# EAGLE design SolarMonitor (EAGLE 9.2.1)
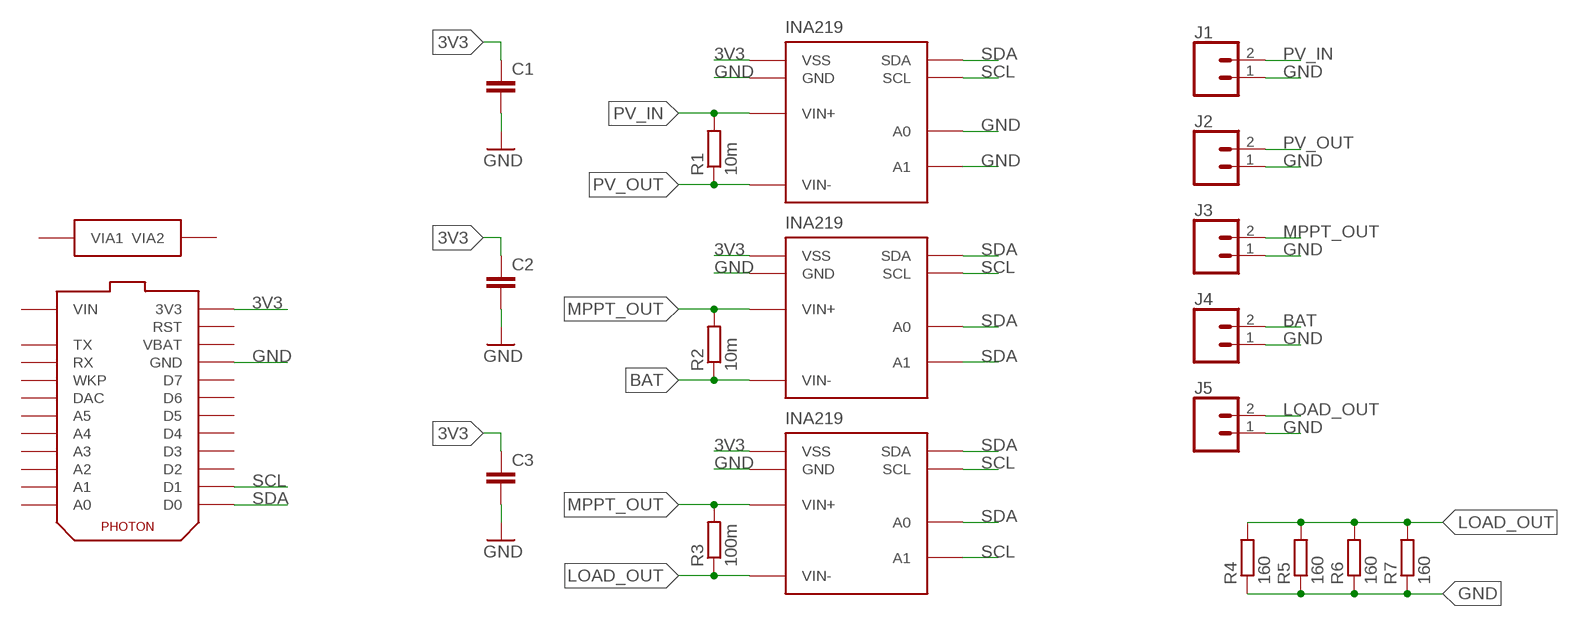
[diagram p0: schematic, sheet 1]

## Parts
C1  C-EU0.1UFC0603  [C0603]
C2  C-EU0.1UFC0603  [C0603]
C3  C-EU0.1UFC0603  [C0603]
J1  CONN_023.5MM  [SCREWTERMINAL-3.5MM-2]
J2  CONN_023.5MM  [SCREWTERMINAL-3.5MM-2]
J3  CONN_023.5MM  [SCREWTERMINAL-3.5MM-2]
J4  CONN_023.5MM  [SCREWTERMINAL-3.5MM-2]
J5  CONN_023.5MM  [SCREWTERMINAL-3.5MM-2]
R1  10m  R-EU_R0805  [R0805]
R2  10m  R-EU_R0805  [R0805]
R3  100m  R-EU_R0805  [R0805]
R4  160  R-EU_R1206  [R1206]
R5  160  R-EU_R1206  [R1206]
R6  160  R-EU_R1206  [R1206]
R7  160  R-EU_R1206  [R1206]
U$1  TEMPLATE_PHOTON_RAW  [PHOTON_RAW]
U$2  INA219  [SOIC_8]
U$3  INA219  [SOIC_8]
U$4  INA219  [SOIC_8]

## Nets
3V3: C1.1 C2.1 C3.1 U$1.3V3 U$1.3V3.(3V3) U$1.3V31(3V3) U$2.5(VSS) U$3.5(VSS) U$4.5(VSS)
BAT: J4.2 R2.1 U$3.7(VIN-)
GND: C1.2 C2.2 C3.2 J1.1 J2.1 J3.1 J4.1 J5.1 R4.1 R5.1 R6.1 R7.1 U$1.GND U$1.GND1(GND) U$1.GND.(GND) U$1.GND.@1(GND) U$1.GND@1(GND) U$1.GND@2(GND) U$2.1(A1) U$2.2(A0) U$2.6(GND) U$3.6(GND) U$4.6(GND)
LOAD_OUT: J5.2 R3.1 R4.2 R5.2 R6.2 R7.2 U$4.7(VIN-)
MPPT_OUT: J3.2 R2.2 R3.2 U$3.8(VIN+) U$4.8(VIN+)
PV_IN: J1.2 R1.2 U$2.8(VIN+)
PV_OUT: J2.2 R1.1 U$2.7(VIN-)
SCL: U$1.D1 U$1.D1.(D1) U$1.D1@1(D1) U$2.4(SCL) U$3.4(SCL) U$4.1(A1) U$4.4(SCL)
SDA: U$1.D0 U$1.D0.(D0) U$1.D0@1(D0) U$2.3(SDA) U$3.1(A1) U$3.2(A0) U$3.3(SDA) U$4.2(A0) U$4.3(SDA)
Unconnected: U$1.A0 U$1.A0.(A0) U$1.A0@1(A0) U$1.A1 U$1.A1.(A1) U$1.A1@1(A1) U$1.A2 U$1.A2.(A2) U$1.A2@1(A2) U$1.A3 U$1.A3.(A3) U$1.A3@1(A3) U$1.A4 U$1.A4.(A4) U$1.A4@1(A4) U$1.A5 U$1.A5.(A5) U$1.A5@1(A5) U$1.D2 U$1.D2.(D2) U$1.D2@1(D2) U$1.D3 U$1.D3.(D3) U$1.D3@1(D3) U$1.D4 U$1.D4.(D4) U$1.D4@1(D4) U$1.D5 U$1.D5.(D5) U$1.D5@1(D5) U$1.D6 U$1.D6.(D6) U$1.D6@1(D6) U$1.D7 U$1.D7.(D7) U$1.D7@1(D7) U$1.DAC U$1.DAC1(DAC) U$1.DAC.(DAC) U$1.P$1(VIA1) U$1.P$2(VIA2) U$1.RST U$1.RST1(RST) U$1.RST.(RST) U$1.RX U$1.RX1(RX) U$1.RX.(RX) U$1.TX U$1.TX1(TX) U$1.TX.(TX) U$1.VBAT U$1.VBAT1(VBAT) U$1.VBAT.(VBAT) U$1.VIN U$1.VIN1(VIN) U$1.VIN.(VIN) U$1.WKP U$1.WKP1(WKP) U$1.WKP.(WKP)

## Library data of the parts
C1-C3 = bschulz:C-EU: CAPACITOR, European symbol; DIGIKEY: 1276-1005-1-ND; MF: Samsung; MPN: CL10B104KO8NNNC
J1-J5 = bschulz:CONN_02: Genaric 2 terminal header SCREW_2.54 <https://www.digikey.com/product-detail/en/on-shore-technology-inc/OSTVN02A150/ED10561-ND/1588862>; PROD_ID: CONN-08399
R1-R7 = bschulz_passives:R-EU_: RESISTOR, European symbol Digikey Parts: Yageo, 0402 <https://www.digikey.com/products/en/resistors/chip-resistor-surface-mount/52?k=&pkeyword=&sf=0&FV=ffec1104%2Cfffc000d%2C1c0002%2C440067%2C1f140000%2Cffe00034%2C400004&quantity=&ColumnSort=0&page=1&stock=1&pageSize=25> Yageo, 0603 <https://www.digikey.com/products/en/resistors/chip-resistor-surface-mount/52?k=&pkeyword=&s=4356&s=47360&sf=0&FV=fffc000d%2C1c0002%2C142c040c%2C1f140000%2Cffe00034&quantity=10&ColumnSort=1000011&page=1&stock=1&pageSize=25> Panasonic, 0603 <https://www.digikey.com/products/en/resistors/chip-resistor-surface-mount/52?k=&pkeyword=&pv252=68&sf=0&FV=ffec373d%2C1c0002%2C142c040c%2C1f140000%2Cffe00034%2C80002%2Cc0001&quantity=&ColumnSort=0&page=1&stock=1&pageSize=25> Panasonic, precision, 0603 <https://www.digikey.com/products/en/resistors/chip-resistor-surface-mount/52?FV=ffec4907%2Cfffc000a%2Cc0172%2C142c040c%2C1f140000%2Cffe00034%2C1c0002&quantity=100&ColumnSort=2085&page=1&stock=1&pageSize=25> Panasonic, 0805 <https://www.digikey.com/products/en/resistors/chip-resistor-surface-mount/52?k=&pkeyword=&pv3=1&sf=0&FV=ffec373d%2C1c0002%2C1f140000%2Cffe00034%2C142c040d&quantity=&ColumnSort=0&page=1&stock=1&pageSize=25> Rohm, current sense <https://www.digikey.com/products/en/resistors/chip-resistor-surface-mount/52?k=&pkeyword=&pv3=1&sf=0&FV=ffecb688%2C1f140000%2Cffe00034%2C1c0002&quantity=&ColumnSort=0&page=1&stock=1&pageSize=25> Vishay, pulse proof automotive <https://www.digikey.com/products/en/resistors/chip-resistor-surface-mount/52?k=&pkeyword=&pv7=2&sf=0&FV=ffec5d6b%2Cffe00034%2C1f140000&quantity=&ColumnSort=0&page=1&stock=1&pageSize=25>
U$1 = voltera_community_lib:TEMPLATE_PHOTON
U$2-U$4 = bschulz:INA219: INA219, TI current sense amplifer, 26V common mode range, 3.3-5v Logic

## Board
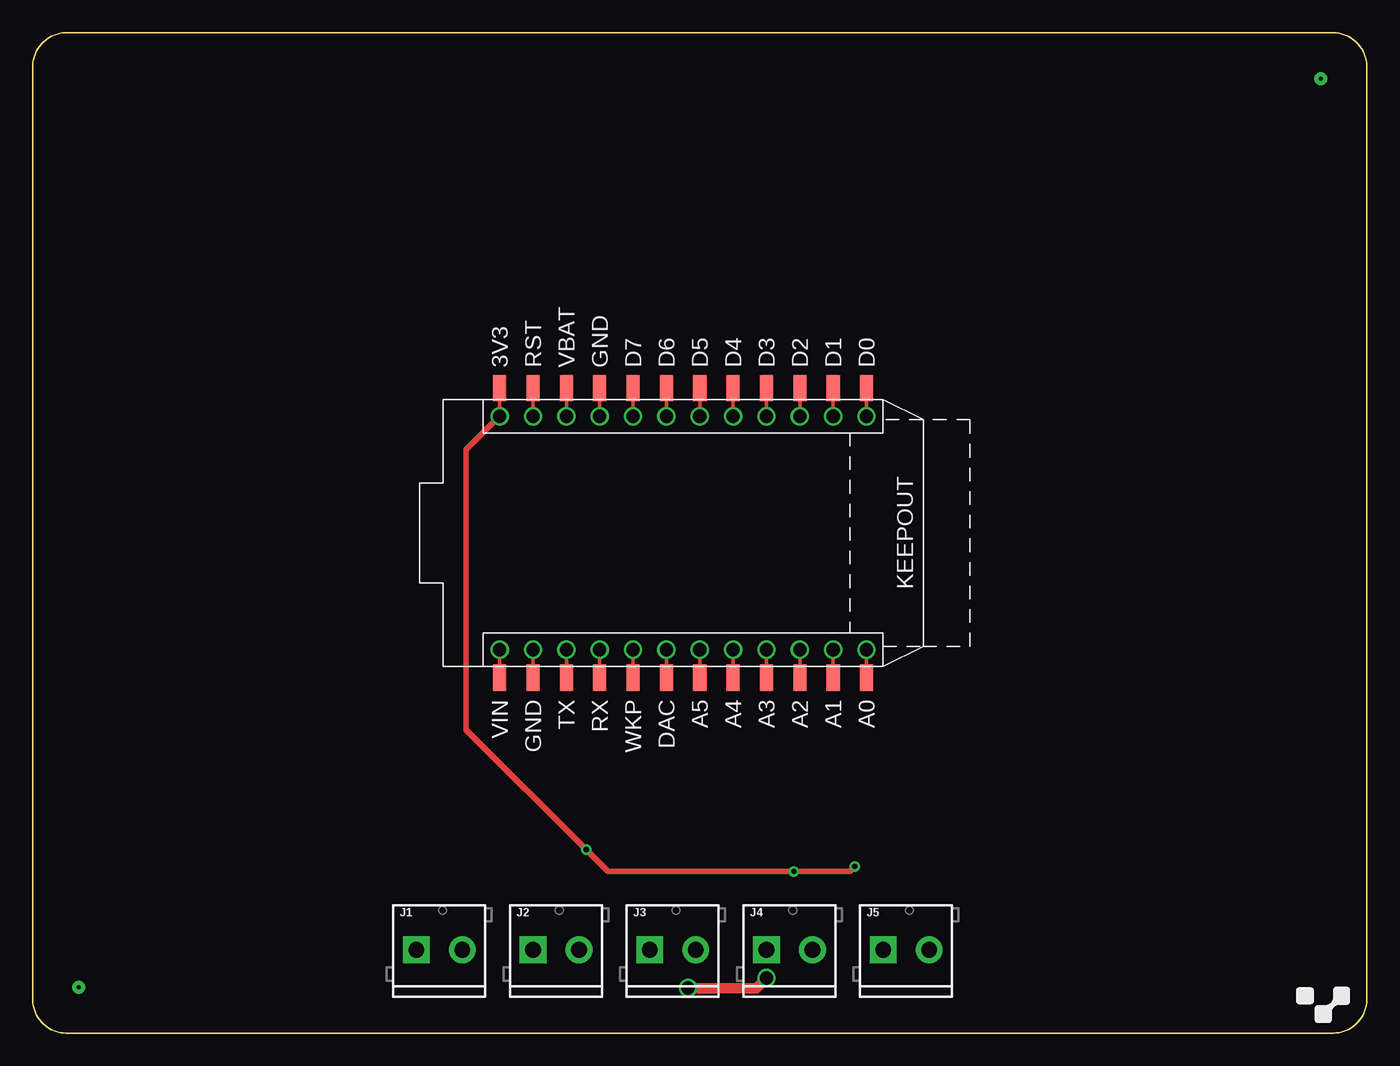
[diagram p1: board, top side]
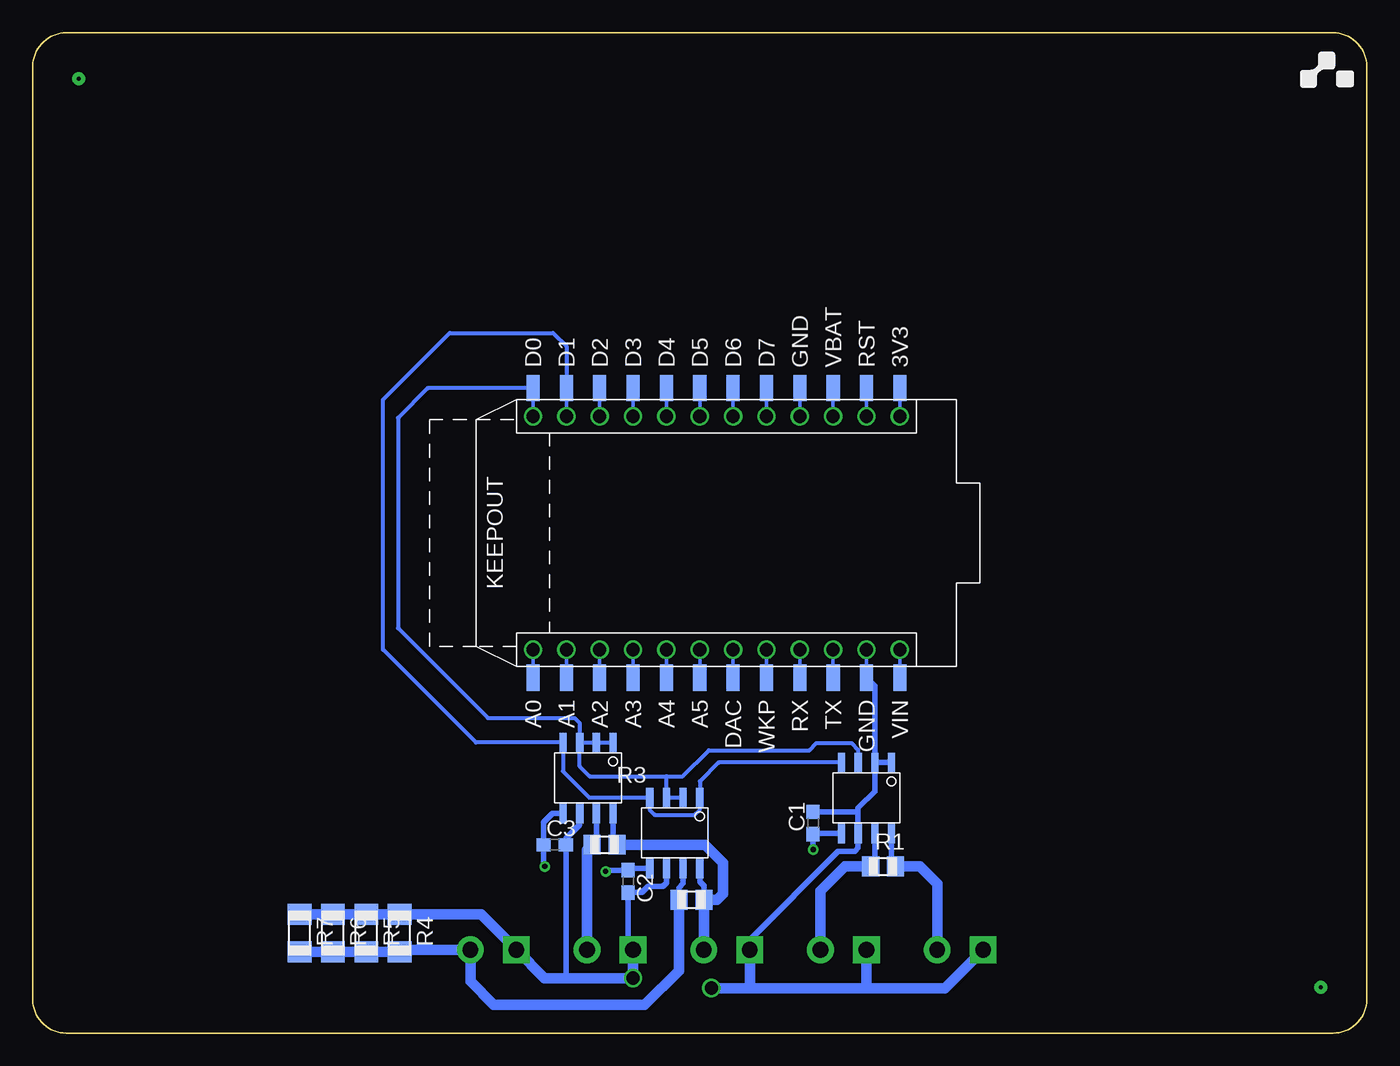
[diagram p2: board, bottom side, seen from below]

Size 101.6 x 76.2 mm. Coordinates in mm from the lower left corner, seen from the top.
Copper layers (1*16): Top 0.035mm / dielectric 1.5mm / Bottom 0.035mm
Design rules "voltera-dru": minimum track width 10mil, minimum drill 0.4mm, track to track 10mil, track to pad 10mil, pad to pad 0.6mm, via to via 0.6mm, smd to smd 0mil, copper to edge 0mil, drill to drill 0.8mm, minimum pad ring 0.2mm, minimum via ring 0.2mm, stop-mask expansion 4mil, vias tented up to drill 0mil, thermal gap 10mil

### Footprints (pad centres in the part's own frame; a part is rotated, then mirrored left to right if it is on the bottom)
C0603 = smd 1.1 x 1: 1 -0.85,0; 2 0.85,0
SCREWTERMINAL-3.5MM-2 = drill 1.2 pad 2.032 square: 1 0,0 | drill 1.2 pad 2.032: 2 3.5,0
R0805 = smd 1.3 x 1.5: 1 -0.95,0; 2 0.95,0
R1206 = smd 1.6 x 1.803: 1 -1.422,0; 2 1.422,0
PHOTON_RAW = smd 1 x 2 bottom: 3V3 35.56,49.13; A0 63.5,27.07; A1 60.96,27.07; A2 58.42,27.07; A3 55.88,27.07; A4 53.34,27.07; A5 50.8,27.07; D0 63.5,49.13; D1 60.96,49.13; D2 58.42,49.13; D3 55.88,49.13; D4 53.34,49.13; D5 50.8,49.13; D6 48.26,49.13; D7 45.72,49.13; DAC 48.26,27.07; GND 38.1,27.07; GND@1 43.18,49.13; RST 38.1,49.13; RX 43.18,27.07; TX 40.64,27.07; VBAT 40.64,49.13; VIN 35.56,27.07; WKP 45.72,27.07 | drill 1: 3V3. 35.56,46.99; A0. 63.5,29.21; A1. 60.96,29.21; A2. 58.42,29.21; A3. 55.88,29.21; A4. 53.34,29.21; A5. 50.8,29.21; D0. 63.5,46.99; D1. 60.96,46.99; D2. 58.42,46.99; D3. 55.88,46.99; D4. 53.34,46.99; D5. 50.8,46.99; D6. 48.26,46.99; D7. 45.72,46.99; DAC. 48.26,29.21; GND. 38.1,29.21; GND.@1 43.18,46.99; RST. 38.1,46.99; RX. 43.18,29.21; TX. 40.64,29.21; VBAT. 40.64,46.99; VIN. 35.56,29.21; WKP. 45.72,29.21 | smd 1 x 2: 3V31 35.56,49.13; A0@1 63.5,27.07; A1@1 60.96,27.07; A2@1 58.42,27.07; A3@1 55.88,27.07; A4@1 53.34,27.07; A5@1 50.8,27.07; D0@1 63.5,49.13; D1@1 60.96,49.13; D2@1 58.42,49.13; D3@1 55.88,49.13; D4@1 53.34,49.13; D5@1 50.8,49.13; D6@1 48.26,49.13; D7@1 45.72,49.13; DAC1 48.26,27.07; GND1 38.1,27.07; GND@2 43.18,49.13; RST1 38.1,49.13; RX1 43.18,27.07; TX1 40.64,27.07; VBAT1 40.64,49.13; VIN1 35.56,27.07; WKP1 45.72,27.07 | drill 0.3 pad 1: P$1 3.5,3.5; P$2 98.1,72.7
SOIC_8 = smd 0.55 x 1.5: 1 -2.54,-2.7; 2 -1.27,-2.7; 3 0,-2.7; 4 1.27,-2.7; 5 1.27,2.7; 6 0,2.7; 7 -1.27,2.7; 8 -2.54,2.7

### Placement (x,y rotation side)
C1  42.16,16 90 bottom
C2  56.26,11.56 270 bottom
C3  61.85,14.35 0 bottom
J1  29.21,6.35 0 top
J2  38.1,6.35 0 top
J3  46.99,6.35 0 top
J4  55.88,6.35 0 top
J5  64.77,6.35 0 top
R1  36.83,12.7 0 bottom
R2  58.04,14.35 0 bottom
R3  51.44,10.16 0 bottom
R4  73.66,7.62 270 bottom
R5  76.2,7.62 270 bottom
R6  78.74,7.62 270 bottom
R7  81.28,7.62 270 bottom
U$1  0,0 0 top
U$2  38.73,17.91 180 bottom
U$3  59.94,19.43 180 bottom
U$4  53.34,15.24 180 bottom

### Tracks (layer width: path | path; a pad name or v marks a point on that pad's centre or on a via)
3V3  (via drill 0.4)
  Top 0.406: v62.61,12.7 62.23,12.32 v57.97,12.32 43.81,12.32 v42.16,13.97 33.02,23.11 33.02,44.45 U$1.3V3.
  Bottom 0.406: U$2.5 42.11,15.21 C1.1 v42.16,13.97 | U$4.5 56.13,12.54 C2.1 57.89,12.41 v57.97,12.32 | U$3.5 62.01,16.73 62.7,16.04 C3.1 62.7,12.79 v62.61,12.7
BAT
  Bottom 0.406: R2.1 58.67,14.67 U$3.7
  Bottom 0.813: J4.2 59.38,13.96 R2.1
GND  (via drill 1)
  Top 0.813: v55.88,4.19 55.12,3.43 v49.91,3.43
  Bottom 0.406: U$2.2 U$2.1 | U$1.GND1 37.47,26.43 U$2.2 | 38.73,16.89 U$2.6 38.73,14.1 38.99,13.84 40.26,13.84 46.99,7.11 J3.1 | 38.73,16.89 38.73,17.14 37.47,18.41 U$2.2 | C1.2 38.77,16.85 38.73,16.89 | U$4.6 53.34,11.43 53.59,11.18 54.74,11.18 55.21,10.71 C2.2 56.26,6.73 J4.1 | U$3.6 59.94,15.88 61,14.82 C3.2 61,4.28 61.09,4.19
  Bottom 0.813: J4.1 v55.88,4.19 61.09,4.19 62.61,4.19 J5.1 67.46,9.04 R4.1 R5.1 R6.1 R7.1 | v49.91,3.43 47.12,3.43 | 47.12,3.43 37.97,3.43 | 37.97,3.43 32.13,3.43 J1.1 | J2.1 38.1,3.56 37.97,3.43 | J3.1 46.99,3.56 47.12,3.43
LOAD_OUT
  Bottom 0.406: U$4.7 52.07,11.4 52.38,11.08 R3.1
  Bottom 0.813: R3.1 52.38,4.76 54.99,2.16 66.49,2.16 68.27,3.94 J5.2 73.51,6.35 R4.2 R5.2 R6.2 R7.2
MPPT_OUT
  Bottom 0.406: R2.2 57.4,14.67 U$3.8 | U$4.8 50.8,11.52 50.48,11.21 R3.2
  Bottom 0.813: J3.2 R3.2 49.47,10.16 49.02,10.61 49.02,12.95 50.42,14.35 R2.2
PV_IN
  Bottom 0.406: U$2.8 36.2,13.02 R1.2
  Bottom 0.813: J1.2 32.71,11.37 34.04,12.7 R1.2
PV_OUT
  Bottom 0.406: U$2.7 37.47,13.02 R1.1
  Bottom 0.813: R1.1 39.75,12.7 41.6,10.85 J2.2
SCL
  Bottom 0.305: U$2.4 49.37,20.61 50.8,19.18 U$4.1 50.8,17.02 51.18,16.64 54.23,16.64 54.61,17.02 U$4.4 59.22,17.94 61.21,19.94 U$3.4 67.85,22.13 74.93,29.21 74.93,48.26 69.85,53.34 61.98,53.34 60.96,52.32 U$1.D1@1
SDA
  Bottom 0.305: U$3.3 59.94,20.32 59.18,19.56 53.34,19.56 | U$4.2 U$4.3 53.34,19.56 | U$2.3 38.73,21.59 39.24,22.1 41.91,22.1 42.46,21.55 50.11,21.55 52.1,19.56 53.34,19.56 | U$3.3 U$3.2 U$3.1 | U$1.D0@1 71.52,49.13 73.79,46.86 73.79,30.86 66.93,24 60.33,24 59.94,23.62 U$3.3